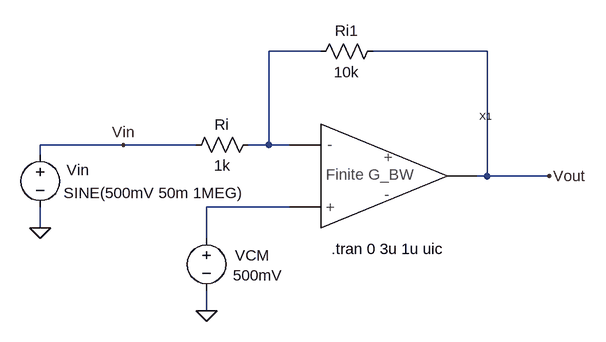
[diagram p0: schematic FiniteGBW_op_amp_x10.asc]
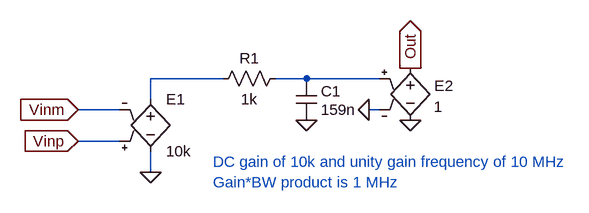
[diagram p1: sub-circuit gain_bw_op_amp.asc]
FiniteGBW_op_amp_x10.asc, the LTspice schematic file:
Version 4
SHEET 1 2760 680
WIRE 912 -320 832 -320
WIRE 1168 -320 992 -320
WIRE 608 -176 480 -176
WIRE 720 -176 608 -176
WIRE 832 -176 832 -320
WIRE 832 -176 800 -176
WIRE 864 -176 832 -176
WIRE 480 -160 480 -176
WIRE 1168 -128 1168 -320
WIRE 1168 -128 1152 -128
WIRE 1264 -128 1168 -128
WIRE 864 -80 736 -80
WIRE 480 -48 480 -80
WIRE 736 -32 736 -80
WIRE 736 80 736 48
FLAG 1264 -128 Vout
FLAG 736 80 0
FLAG 480 -48 0
FLAG 608 -176 Vin
SYMBOL res 704 -160 R270
WINDOW 0 32 56 VTop 0
WINDOW 3 0 56 VBottom 0
SYMATTR InstName Ri
SYMATTR Value 1k
SYMBOL res 896 -304 R270
WINDOW 0 32 56 VTop 0
WINDOW 3 0 56 VBottom 0
SYMATTR InstName Ri1
SYMATTR Value 10k
SYMBOL voltage 736 -48 R0
WINDOW 0 44 42 Left 0
WINDOW 3 41 73 Left 0
SYMATTR InstName VCM
SYMATTR Value 500mV
SYMBOL voltage 480 -176 R0
WINDOW 0 41 39 Left 0
WINDOW 3 36 74 Left 0
WINDOW 123 0 0 Left 0
WINDOW 39 0 0 Left 0
SYMATTR InstName Vin
SYMATTR Value SINE(500mV 50m 1MEG)
SYMBOL Gain_BW_op_amp 912 -128 R0
SYMATTR InstName X1
TEXT 928 -16 Left 0 !.tran 0 3u 1u uic

gain_bw_op_amp.asc, the sub-circuit schematic file:
Version 4
SHEET 1 6300 692
WIRE 1424 288 1360 288
WIRE 1424 336 1360 336
WIRE 1472 272 1472 240
WIRE 1472 384 1472 352
WIRE 1584 240 1472 240
WIRE 1712 240 1664 240
WIRE 1824 240 1712 240
WIRE 1824 288 1808 288
FLAG 1472 384 0
FLAG 1360 288 Vinm
IOPIN 1360 288 In
FLAG 1360 336 Vinp
IOPIN 1360 336 In
FLAG 1872 224 Out
IOPIN 1872 224 Out
FLAG 1712 304 0
FLAG 1808 288 0
FLAG 1872 304 0
SYMBOL e2 1472 256 R0
SYMATTR InstName E1
SYMATTR Value 10k
SYMBOL res 1680 224 R90
WINDOW 0 0 56 VBottom 0
WINDOW 3 32 56 VTop 0
SYMATTR InstName R1
SYMATTR Value 1k
SYMBOL cap 1696 240 R0
WINDOW 0 38 19 Left 0
WINDOW 3 38 48 Left 0
SYMATTR InstName C1
SYMATTR Value 159n
SYMBOL e 1872 208 R0
WINDOW 0 37 43 Left 0
WINDOW 3 36 75 Left 0
SYMATTR InstName E2
SYMATTR Value 1
TEXT 1568 368 Left 0 ;DC gain of 10k and unity gain frequency of 10 MHz\nGain*BW product is 1 MHz

The netlist it stands for:
* FiniteGBW_op_amp_x10.asc
Ri Vin N001 1k
Ri1 N001 Vout 10k
VCM N002 0 500mV
Vin Vin 0 SINE(500mV 50m 1MEG)
XX1 N001 N002 Vout gain_bw_op_amp

* block symbol definitions
.subckt gain_bw_op_amp Vinm Vinp Out
E1 N001 0 Vinp Vinm 10k
R1 N002 N001 1k
C1 N002 0 159n
E2 Out 0 N002 0 1
* DC gain of 10k and unity gain frequency of 10 MHz
* Gain*BW product is 1 MHz
.ends gain_bw_op_amp

.tran 0 3u 1u uic
.backanno
.end